# EAGLE design IORJ45 (EAGLE 9.4.2)
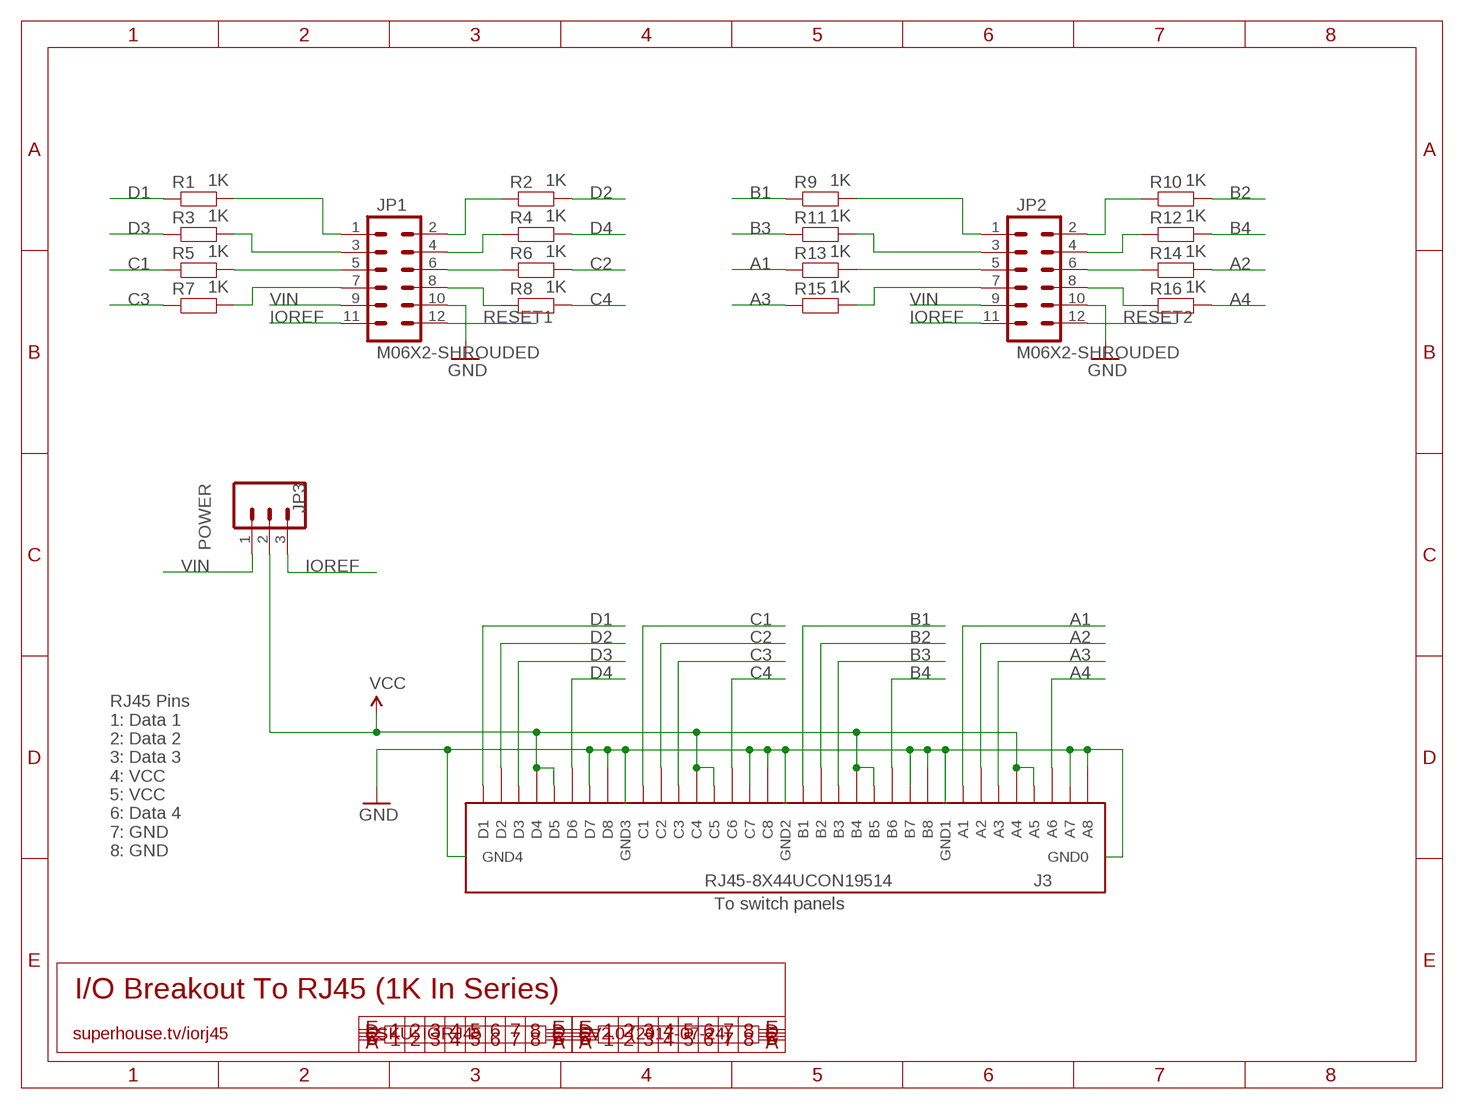
[diagram p0: schematic, sheet 1]

## Parts
J3  RJ45-8X44UCON19514  [RJ45-8X4]
JP1  M06X2-SHROUDED  [2X6-SHROUDED]
JP2  M06X2-SHROUDED  [2X6-SHROUDED]
JP3  POWER  M03-PIN  [1X03-P]
R1  1K  RESISTOR0603  [R0603]
R2  1K  RESISTOR0603  [R0603]
R3  1K  RESISTOR0603  [R0603]
R4  1K  RESISTOR0603  [R0603]
R5  1K  RESISTOR0603  [R0603]
R6  1K  RESISTOR0603  [R0603]
R7  1K  RESISTOR0603  [R0603]
R8  1K  RESISTOR0603  [R0603]
R9  1K  RESISTOR0603  [R0603]
R10  1K  RESISTOR0603  [R0603]
R11  1K  RESISTOR0603  [R0603]
R12  1K  RESISTOR0603  [R0603]
R13  1K  RESISTOR0603  [R0603]
R14  1K  RESISTOR0603  [R0603]
R15  1K  RESISTOR0603  [R0603]
R16  1K  RESISTOR0603  [R0603]

## Nets
A1: J3.A1 R13.1
A2: J3.A2 R14.2
A3: J3.A3 R15.1
A4: J3.A6 R16.2
B1: J3.B1 R9.1
B2: J3.B2 R10.2
B3: J3.B3 R11.1
B4: J3.B6 R12.2
C1: J3.C1 R5.1
C2: J3.C2 R6.2
C3: J3.C3 R7.1
C4: J3.C6 R8.2
D1: J3.D1 R1.1
D2: J3.D2 R2.2
D3: J3.D3 R3.1
D4: J3.D6 R4.2
GND: J3.A7 J3.A8 J3.B7 J3.B8 J3.C7 J3.C8 J3.D7 J3.D8 J3.GND0 J3.GND1 J3.GND2 J3.GND3 J3.GND4 JP1.10 JP2.10
IOREF: JP1.11 JP2.11 JP3.3
N$1: JP2.5 R13.2
N$2: JP1.5 R5.2
N$3: JP1.3 R3.2
N$4: JP1.1 R1.2
N$5: JP1.7 R7.2
N$6: JP2.3 R11.2
N$7: JP2.1 R9.2
N$8: JP1.8 R8.1
N$9: JP1.6 R6.1
N$10: JP1.4 R4.1
N$11: JP1.2 R2.1
N$12: JP2.7 R15.2
N$15: JP2.6 R14.1
N$16: JP2.8 R16.1
N$17: JP2.4 R12.1
N$18: JP2.2 R10.1
RESET1: JP1.12
RESET2: JP2.12
VCC: J3.A4 J3.A5 J3.B4 J3.B5 J3.C4 J3.C5 J3.D4 J3.D5 JP3.2
VIN: JP1.9 JP2.9 JP3.1

## Notes on the sheet
- RJ45 Pins
  1: Data 1
  2: Data 2
  3: Data 3
  4: VCC
  5: VCC
  6: Data 4
  7: GND
  8: GND
- To switch panels
- I/O Breakout To RJ45 (1K In Series)
- superhouse.tv/iorj45 | SKU: IORJ45 | V2.0 (2017-07-24)

## Library data of the parts
J3 = SuperHouse-Connectors:RJ45-8X4: 4-port RJ45 socket
JP1 JP2 = SuperHouse-Connectors:M06X2: M12 header in 2x6 format
JP3 = SuperHouse-Connectors:M03: 3-way header Standard 1x3 header, and screw terminal variations
R1-R16 = SuperHouse-DiscreteSemi:RESISTOR: Resistor Standard resistors.

## Board
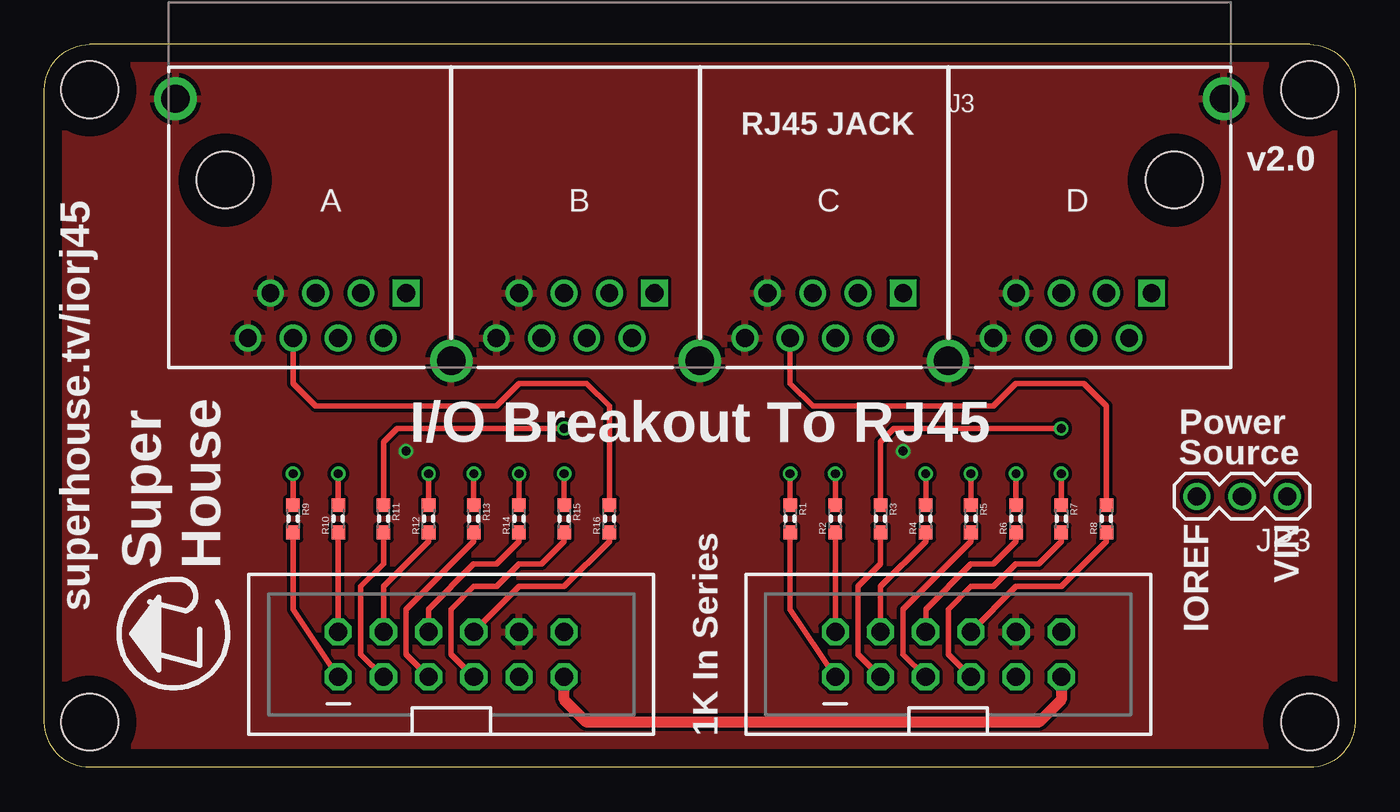
[diagram p1: board, top side]
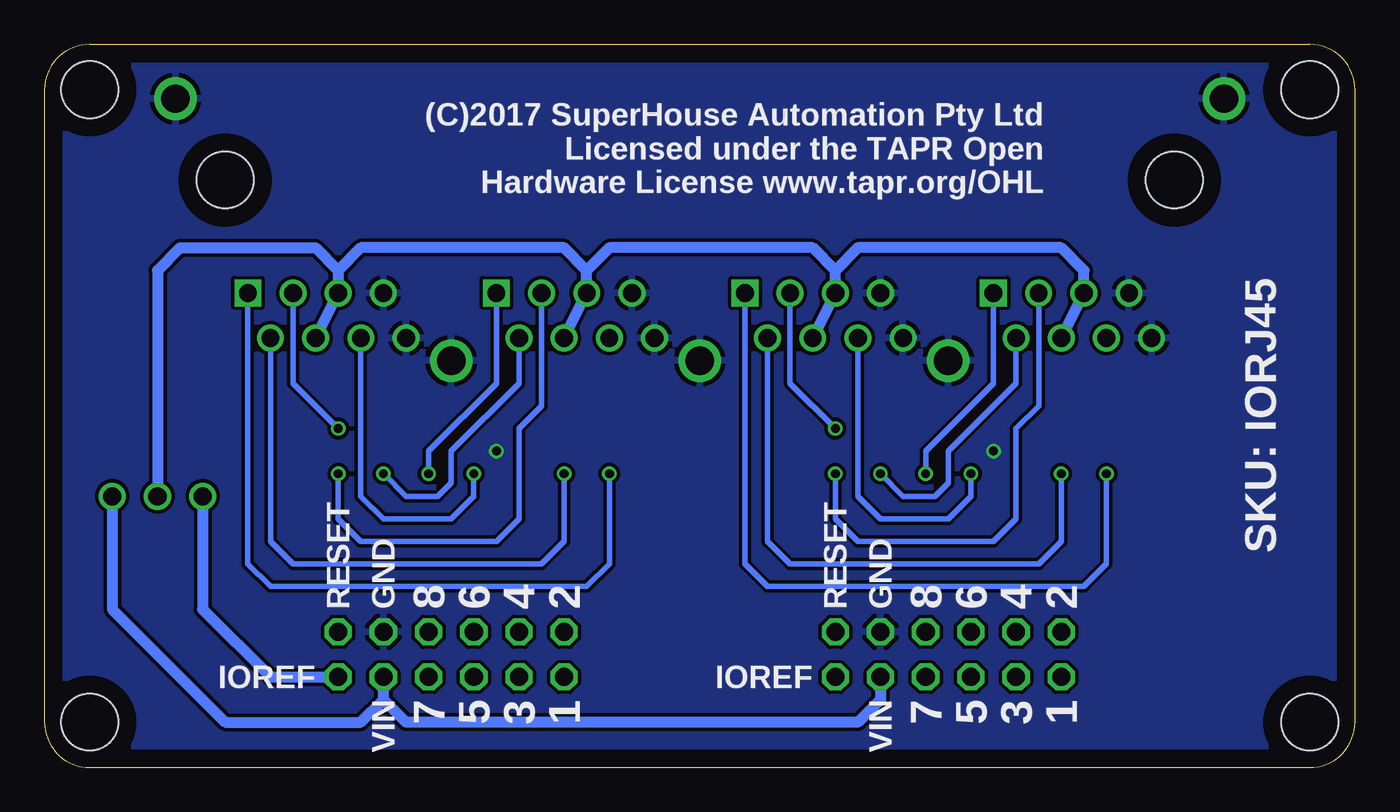
[diagram p2: board, bottom side, seen from below]

Size 73.66 x 40.64 mm. Coordinates in mm from the lower left corner, seen from the top.
Outline: 71.12,40.64 2.54,40.64 arc90 0,38.1 0,2.54 arc90 2.54,0 71.12,0 arc90 73.66,2.54 73.66,38.1 arc90 71.12,40.64
Copper layers (1*16): Top 0.035mm / dielectric 1.5mm / Bottom 0.035mm
Design rules "default *": minimum track width 10mil, minimum drill 24mil, track to track 8mil, track to pad 8mil, pad to pad 8mil, via to via 8mil, smd to smd 8mil, copper to edge 40mil, drill to drill 8mil, minimum pad ring 10mil, minimum via ring 6mil, stop-mask expansion 4mil, vias tented up to drill 0mil, thermal gap 10mil
Holes 3.2 mm at 71.12,38.1 2.54,38.1 2.54,2.54 71.12,2.54

### Footprints (pad centres in the part's own frame; a part is rotated, then mirrored left to right if it is on the bottom)
RJ45-8X4 = drill 1 square: A1 -16.51,-6.35; B1 -2.54,-6.35; C1 11.43,-6.35; D1 25.4,-6.35 | drill 1: A2 -17.78,-8.89; A3 -19.05,-6.35; A4 -20.32,-8.89; A5 -21.59,-6.35; A6 -22.86,-8.89; A7 -24.13,-6.35; A8 -25.4,-8.89; B2 -3.81,-8.89; B3 -5.08,-6.35; B4 -6.35,-8.89; B5 -7.62,-6.35; B6 -8.89,-8.89; B7 -10.16,-6.35; B8 -11.43,-8.89; C2 10.16,-8.89; C3 8.89,-6.35; C4 7.62,-8.89; C5 6.35,-6.35; C6 5.08,-8.89; C7 3.81,-6.35; C8 2.54,-8.89; D2 24.13,-8.89; D3 22.86,-6.35; D4 21.59,-8.89; D5 20.32,-6.35; D6 19.05,-8.89; D7 17.78,-6.35; D8 16.51,-8.89 | drill 1.6: GND0 -29.464,4.572; GND1 -13.97,-10.16; GND2 0,-10.16; GND3 13.97,-10.16; GND4 29.464,4.572 | hole 3.2: -26.67,0; 26.67,0
2X6-SHROUDED = drill 1.016 octagon: 1 0,0; 2 2.54,0; 3 0,-2.54; 4 2.54,-2.54; 5 0,-5.08; 6 2.54,-5.08; 7 0,-7.62; 8 2.54,-7.62; 9 0,-10.16; 10 2.54,-10.16; 11 0,-12.7; 12 2.54,-12.7
1X03-P = drill 1.016: 1 0,0; 2 2.54,0; 3 5.08,0
R0603 = smd 0.762 x 0.762: 1 -0.762,0; 2 0.762,0

### Placement (x,y rotation side)
J3  36.83,33.02 0 top
JP1  44.45,5.08 90 top
JP2  16.51,5.08 90 top
JP3  69.85,15.24 180 top
R1  41.91,13.97 270 top
R2  44.45,13.97 90 top
R3  46.99,13.97 270 top
R4  49.53,13.97 90 top
R5  52.07,13.97 270 top
R6  54.61,13.97 90 top
R7  57.15,13.97 270 top
R8  59.69,13.97 90 top
R9  13.97,13.97 270 top
R10  16.51,13.97 90 top
R11  19.05,13.97 270 top
R12  21.59,13.97 90 top
R13  24.13,13.97 270 top
R14  26.67,13.97 90 top
R15  29.21,13.97 270 top
R16  31.75,13.97 90 top

### Tracks (layer width: path | path; a pad name or v marks a point on that pad's centre or on a via)
A1  (via drill 0.5)
  Top 0.305: R13.1 v24.13,16.51
  Bottom 0.305: J3.A1 20.32,21.59 24.13,17.78 v24.13,16.51
A2  (via drill 0.5)
  Top 0.305: R14.2 v26.67,16.51
  Bottom 0.305: J3.A2 19.05,21.59 22.86,17.78 22.86,16 23.62,15.24 25.4,15.24 v26.67,16.51
A3  (via drill 0.5)
  Top 0.305: R15.1 v29.21,16.51
  Bottom 0.305: J3.A3 17.78,20.32 19.05,19.05 19.05,13.97 20.32,12.7 27.94,12.7 29.21,13.97 v29.21,16.51
A4
  Top 0.305: R16.2 31.75,20.32 30.48,21.59 26.67,21.59 25.4,20.32 15.24,20.32 13.97,21.59 J3.A6
B1  (via drill 0.5)
  Top 0.305: R9.1 v13.97,16.51
  Bottom 0.305: v13.97,16.51 13.97,11.43 15.24,10.16 33.02,10.16 34.29,11.43 J3.B1
B2  (via drill 0.5)
  Top 0.305: R10.2 v16.51,16.51
  Bottom 0.305: J3.B2 33.02,12.7 31.75,11.43 17.78,11.43 16.51,12.7 v16.51,16.51
B3  (via drill 0.5)
  Top 0.305: R11.1 19.05,18.29 19.81,19.05 v29.21,19.05
  Bottom 0.305: J3.B3 31.75,21.59 v29.21,19.05
B4  (via drill 0.5)
  Top 0.305: R12.2 v21.59,16.51
  Bottom 0.305: J3.B6 27.94,15.24 26.67,13.97 22.86,13.97 21.59,15.24 v21.59,16.51
C1  (via drill 0.5)
  Top 0.305: R5.1 v52.07,16.51
  Bottom 0.305: J3.C1 48.26,21.59 52.07,17.78 v52.07,16.51
C2  (via drill 0.5)
  Top 0.305: R6.2 v54.61,16.51
  Bottom 0.305: J3.C2 46.99,21.59 50.8,17.78 50.8,16 51.56,15.24 53.34,15.24 v54.61,16.51
C3  (via drill 0.5)
  Top 0.305: R7.1 v57.15,16.51
  Bottom 0.305: J3.C3 45.72,20.32 46.99,19.05 46.99,13.97 48.26,12.7 55.88,12.7 57.15,13.97 v57.15,16.51
C4
  Top 0.305: J3.C6 41.91,21.59 43.18,20.32 53.34,20.32 54.61,21.59 58.42,21.59 59.69,20.32 R8.2
D1  (via drill 0.5)
  Top 0.305: R1.1 v41.91,16.51
  Bottom 0.305: v41.91,16.51 41.91,11.43 43.18,10.16 60.96,10.16 62.23,11.43 J3.D1
D2  (via drill 0.5)
  Top 0.305: R2.2 v44.45,16.51
  Bottom 0.305: v44.45,16.51 44.45,12.7 45.72,11.43 59.69,11.43 60.96,12.7 J3.D2
D3  (via drill 0.5)
  Top 0.305: R3.1 46.99,18.29 47.75,19.05 v57.15,19.05
  Bottom 0.305: v57.15,19.05 59.69,21.59 J3.D3
D4  (via drill 0.5)
  Top 0.305: R4.2 v49.53,16.51
  Bottom 0.305: J3.D6 55.88,15.24 54.61,13.97 50.8,13.97 49.53,15.24 v49.53,16.51
GND  (via drill 0.5)
  other vias: 48.26,17.78 20.32,17.78
  pour Bottom: 73.66,38.1 73.66,2.54 arc-90 71.12,0 2.54,0 arc-90 0,2.54 0,38.1 arc-90 2.54,40.64 71.12,40.64 arc-90
  pour Top: 2.54,40.64 71.12,40.64 arc-90 73.66,38.1 73.66,2.54 arc-90 71.12,0 2.54,0 arc-90 0,2.54 0,38.1 arc-90
IOREF
  Top 0.61: JP1.11 57.15,3.81 55.88,2.54 30.48,2.54 29.21,3.81 JP2.11
  Bottom 0.61: JP3.3 64.77,8.89 60.96,5.08 JP1.11
N$1
  Top 0.305: JP2.5 20.32,6.35 20.32,8.89 24.13,12.7 R13.2
N$2
  Top 0.305: JP1.5 48.26,6.35 48.26,8.89 52.07,12.7 R5.2
N$3
  Top 0.305: R3.2 46.99,11.43 45.72,10.16 45.72,6.35 JP1.3
N$4
  Top 0.305: JP1.1 41.91,8.89 R1.2
N$5
  Top 0.305: JP1.7 50.8,6.35 50.8,8.89 52.07,10.16 53.34,10.16 54.61,11.43 55.88,11.43 57.15,12.7 R7.2
N$6
  Top 0.305: JP2.3 17.78,6.35 17.78,10.16 19.05,11.43 R11.2
N$7
  Top 0.305: JP2.1 13.97,8.89 R9.2
N$8
  Top 0.305: JP1.8 54.61,10.16 57.15,10.16 59.69,12.7 R8.1
N$9
  Top 0.305: JP1.6 49.53,8.89 52.07,11.43 53.34,11.43 54.61,12.7 R6.1
N$10
  Top 0.305: R4.1 49.53,12.7 46.99,10.16 JP1.4
N$11
  Top 0.305: JP1.2 R2.1
N$12
  Top 0.305: JP2.7 22.86,6.35 22.86,8.89 24.13,10.16 25.4,10.16 26.67,11.43 27.94,11.43 29.21,12.7 R15.2
N$15
  Top 0.305: R14.1 26.67,12.7 25.4,11.43 24.13,11.43 21.59,8.89 JP2.6
N$16
  Top 0.305: R16.1 31.75,12.7 29.21,10.16 26.67,10.16 JP2.8
N$17
  Top 0.305: R12.1 21.59,12.7 19.05,10.16 JP2.4
N$18
  Top 0.305: JP2.2 R10.1
VCC
  Bottom 0.61: J3.D4 J3.D5 57.15,27.94 | J3.C4 J3.C5 43.18,27.94 | J3.B4 J3.B5 29.21,27.94 | J3.A4 J3.A5 15.24,27.94 16.51,29.21 27.94,29.21 29.21,27.94 | JP3.2 67.31,27.94 66.04,29.21 58.42,29.21 57.15,27.94 | 43.18,27.94 44.45,29.21 55.88,29.21 57.15,27.94 | 29.21,27.94 30.48,29.21 41.91,29.21 43.18,27.94
VIN
  Bottom 0.61: 54.61,3.81 55.88,2.54 63.5,2.54 69.85,8.89 JP3.1 | 54.61,3.81 JP1.9 | JP2.9 26.67,3.81 27.94,2.54 53.34,2.54 54.61,3.81

### Text on the board
tPlace: RJ45 JACK | v2.0 | superhouse.tv/iorj45 | I/O Breakout To RJ45 | Power / Source | IOREF | VIN | Super / House | 1K In Series
bPlace: (C)2017 SuperHouse Automation Pty Ltd / Licensed under the TAPR Open / Hardware License www.tapr.org/OHL | SKU: IORJ45 | 2 | 4 | 6 | 8 | GND | RESET | 2 | 4 | 6 | 8 | GND | RESET | IOREF | IOREF | 1 | 3 | 5 | 7 | VIN | 1 | 3 | 5 | 7 | VIN